# EAGLE design Arduino-DUE-SHEILD-4X4 (EAGLE 8.1.0)
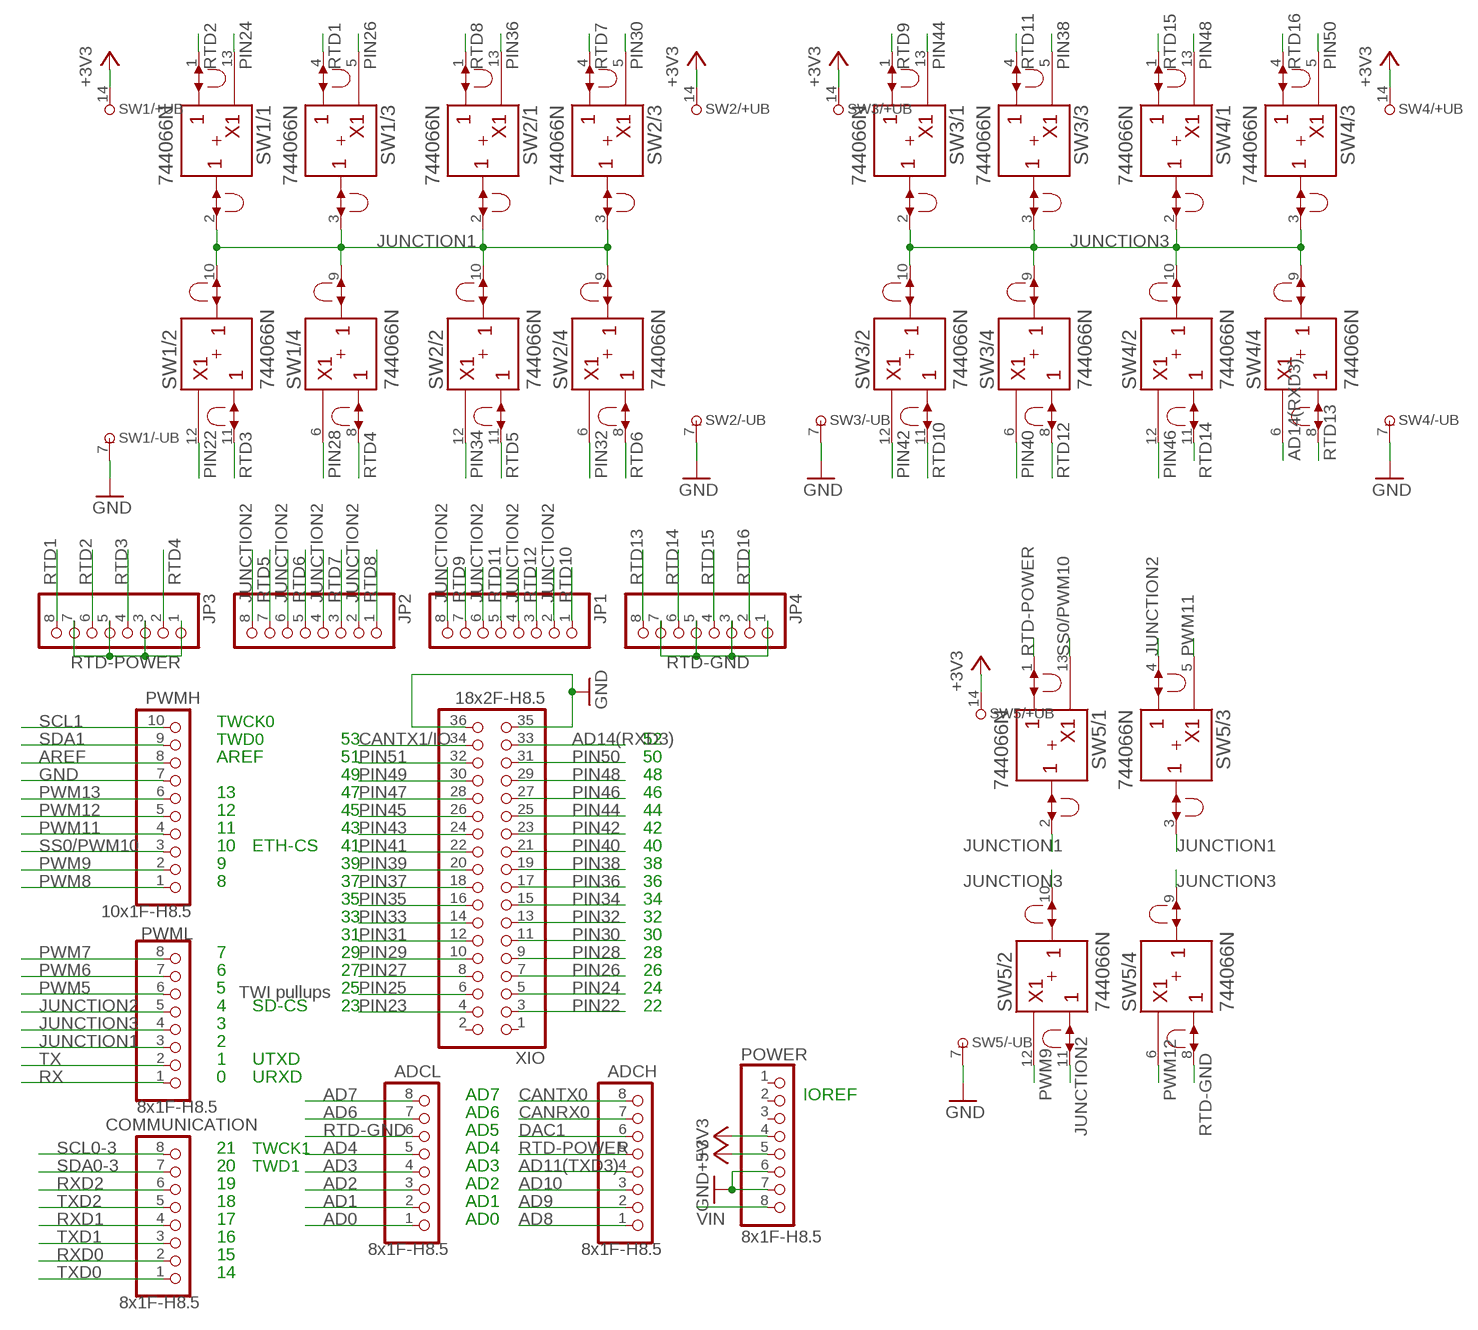
[diagram p0: schematic, sheet 1]

## Parts
ADCH  8x1F-H8.5  PINHD-1X8  [1X08]
ADCL  8x1F-H8.5  PINHD-1X8  [1X08]
COMMUNICATION  8x1F-H8.5  PINHD-1X8  [1X08]
JP1  PINHD-1X8  [1X08]
JP2  PINHD-1X8  [1X08]
JP3  PINHD-1X8  [1X08]
JP4  PINHD-1X8  [1X08]
POWER  8x1F-H8.5  PINHD-1X8  [1X08]
PWMH  10x1F-H8.5  PINHD-1X10  [1X10]
PWML  8x1F-H8.5  PINHD-1X8  [1X08]
SW1  744066N  [DIL14]
SW2  744066N  [DIL14]
SW3  744066N  [DIL14]
SW4  744066N  [DIL14]
SW5  744066N  [DIL14]
XIO  18x2F-H8.5  PINHD-2X18  [2X18]

## Nets
+3V3: POWER.4 SW1.14(/+UB:+UB) SW2.14(/+UB:+UB) SW3.14(/+UB:+UB) SW4.14(/+UB:+UB) SW5.14(/+UB:+UB)
+5V: POWER.5
AD0: ADCL.1
AD1: ADCL.2
AD2: ADCL.3
AD3: ADCL.4
AD4: ADCL.5
AD6: ADCL.7
AD7: ADCL.8
AD8: ADCH.1
AD9: ADCH.2
AD10: ADCH.3
AD11(TXD3): ADCH.4
AD14(RXD3): SW4.6(/4:C) XIO.33
AREF: PWMH.8
CANRX0: ADCH.7
CANTX0: ADCH.8
CANTX1/IO: XIO.34
DAC1: ADCH.6
GND: POWER.6 POWER.7 PWMH.7 SW1.7(/-UB:-UB) SW2.7(/-UB:-UB) SW3.7(/-UB:-UB) SW4.7(/-UB:-UB) SW5.7(/-UB:-UB) XIO.35 XIO.36
JUNCTION1: PWML.3 SW1.2(/1:B) SW1.3(/3:B) SW1.9(/4:B) SW1.10(/2:B) SW2.2(/1:B) SW2.3(/3:B) SW2.9(/4:B) SW2.10(/2:B) SW5.2(/1:B) SW5.3(/3:B)
JUNCTION2: JP1.2 JP1.4 JP1.6 JP1.8 JP2.2 JP2.4 JP2.6 JP2.8 PWML.5 SW5.4(/3:A) SW5.11(/2:A)
JUNCTION3: PWML.4 SW3.2(/1:B) SW3.3(/3:B) SW3.9(/4:B) SW3.10(/2:B) SW4.2(/1:B) SW4.3(/3:B) SW4.9(/4:B) SW4.10(/2:B) SW5.9(/4:B) SW5.10(/2:B)
PIN22: SW1.12(/2:C) XIO.3
PIN23: XIO.4
PIN24: SW1.13(/1:C) XIO.5
PIN25: XIO.6
PIN26: SW1.5(/3:C) XIO.7
PIN27: XIO.8
PIN28: SW1.6(/4:C) XIO.9
PIN29: XIO.10
PIN30: SW2.5(/3:C) XIO.11
PIN31: XIO.12
PIN32: SW2.6(/4:C) XIO.13
PIN33: XIO.14
PIN34: SW2.12(/2:C) XIO.15
PIN35: XIO.16
PIN36: SW2.13(/1:C) XIO.17
PIN37: XIO.18
PIN38: SW3.5(/3:C) XIO.19
PIN39: XIO.20
PIN40: SW3.6(/4:C) XIO.21
PIN41: XIO.22
PIN42: SW3.12(/2:C) XIO.23
PIN43: XIO.24
PIN44: SW3.13(/1:C) XIO.25
PIN45: XIO.26
PIN46: SW4.12(/2:C) XIO.27
PIN47: XIO.28
PIN48: SW4.13(/1:C) XIO.29
PIN49: XIO.30
PIN50: SW4.5(/3:C) XIO.31
PIN51: XIO.32
PWM5: PWML.6
PWM6: PWML.7
PWM7: PWML.8
PWM8: PWMH.1
PWM9: PWMH.2 SW5.12(/2:C)
PWM11: PWMH.4 SW5.5(/3:C)
PWM12: PWMH.5 SW5.6(/4:C)
PWM13: PWMH.6
RTD1: JP3.8 SW1.4(/3:A)
RTD2: JP3.6 SW1.1(/1:A)
RTD3: JP3.4 SW1.11(/2:A)
RTD4: JP3.2 SW1.8(/4:A)
RTD5: JP2.7 SW2.11(/2:A)
RTD6: JP2.5 SW2.8(/4:A)
RTD7: JP2.3 SW2.4(/3:A)
RTD8: JP2.1 SW2.1(/1:A)
RTD9: JP1.7 SW3.1(/1:A)
RTD10: JP1.1 SW3.11(/2:A)
RTD11: JP1.5 SW3.4(/3:A)
RTD12: JP1.3 SW3.8(/4:A)
RTD13: JP4.8 SW4.8(/4:A)
RTD14: JP4.6 SW4.11(/2:A)
RTD15: JP4.4 SW4.1(/1:A)
RTD16: JP4.2 SW4.4(/3:A)
RTD-GND: ADCL.6 JP4.1 JP4.3 JP4.5 JP4.7 SW5.8(/4:A)
RTD-POWER: ADCH.5 JP3.1 JP3.3 JP3.5 JP3.7 SW5.1(/1:A)
RX: PWML.1
RXD0: COMMUNICATION.2
RXD1: COMMUNICATION.4
RXD2: COMMUNICATION.6
SCL0-3: COMMUNICATION.8
SCL1: PWMH.10
SDA0-3: COMMUNICATION.7
SDA1: PWMH.9
SS0/PWM10: PWMH.3 SW5.13(/1:C)
TX: PWML.2
TXD0: COMMUNICATION.1
TXD1: COMMUNICATION.3
TXD2: COMMUNICATION.5
VIN: POWER.8
Unconnected: POWER.1 POWER.2 POWER.3 XIO.1 XIO.2

## Notes on the sheet
- TWCK0
- TWD0 | 53 | 52
- AREF | 51 | 50
- 49 | 48
- 13 | 47 | 46
- 12 | 45 | 44
- 11 | 43 | 42
- 10 | ETH-CS | 41 | 40
- 9 | 39 | 38
- 8 | 37 | 36
- 35 | 34
- 33 | 32
- 31 | 30
- 7 | 29 | 28
- 6 | 27 | 26
- 5 | TWI pullups | 25 | 24
- 4 | SD-CS | 23 | 22
- 3
- 2
- 1 | UTXD
- 0 | URXD
- AD7 | IOREF
- AD6
- AD5
- 21 | TWCK1 | AD4
- 20 | TWD1 | AD3
- 19 | AD2
- 18 | AD1
- 17 | AD0
- 16
- 15
- 14

## Library data of the parts
ADCH ADCL COMMUNICATION POWER PWML = SmartPrj:PINHD-1X8: PIN HEADER
JP1-JP4 = pinhead:PINHD-1X8: PIN HEADER
PWMH = SmartPrj:PINHD-1X10: PIN HEADER
SW1-SW5 = 74ttl-din:74*4066: Quad analog SWITCH
XIO = SmartPrj:PINHD-2X18: PIN HEADER

## Net classes
0 default: width 0.203 mm, drill 0.406 mm, clearance 0.203 mm
1 USB: width 0.203 mm, drill 0.406 mm, clearance 0.203 mm
2 gnd: width 0.203 mm, drill 0.406 mm, clearance 0.203 mm
3 usbvcc: width 0.203 mm, drill 0.406 mm, clearance 0.203 mm
4 USBpair: width 0.254 mm, drill 0.406 mm, clearance 0.61 mm

## Board
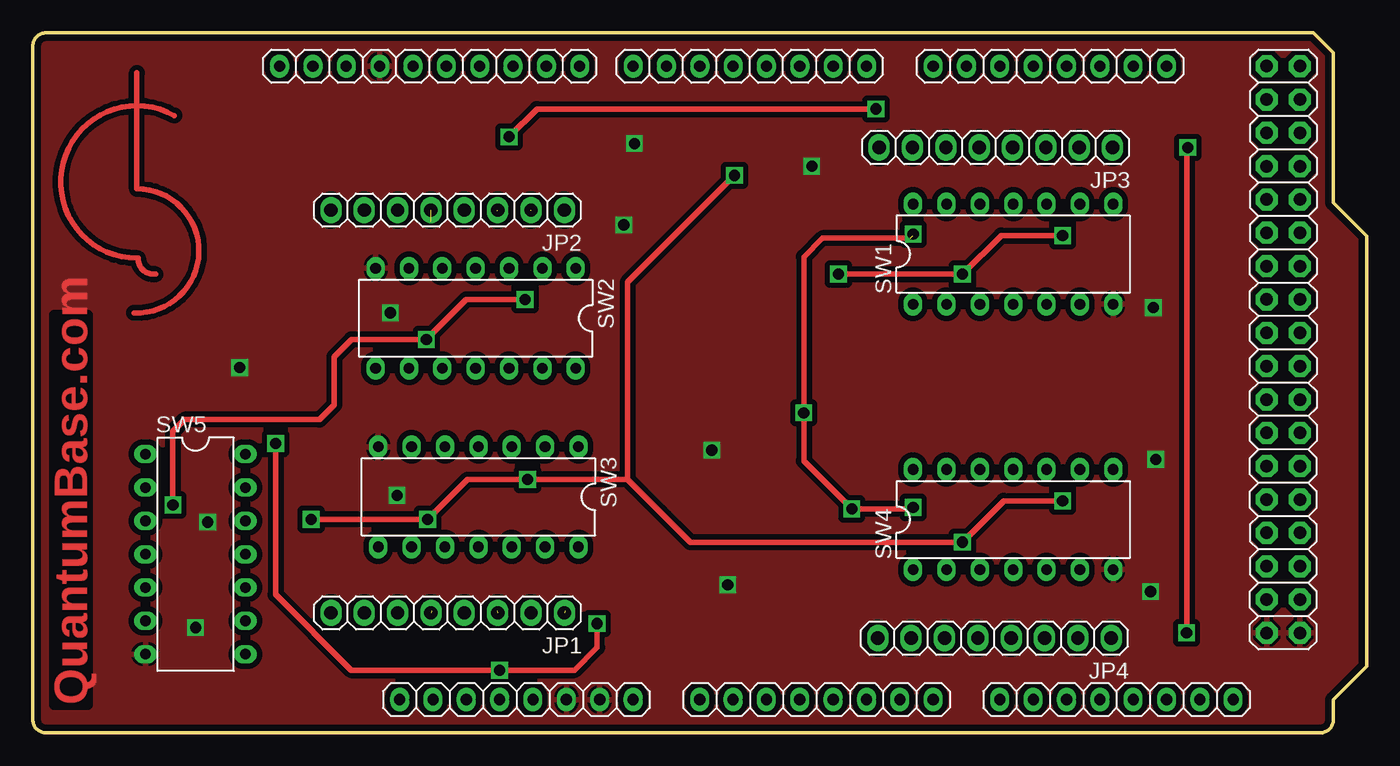
[diagram p1: board, top side]
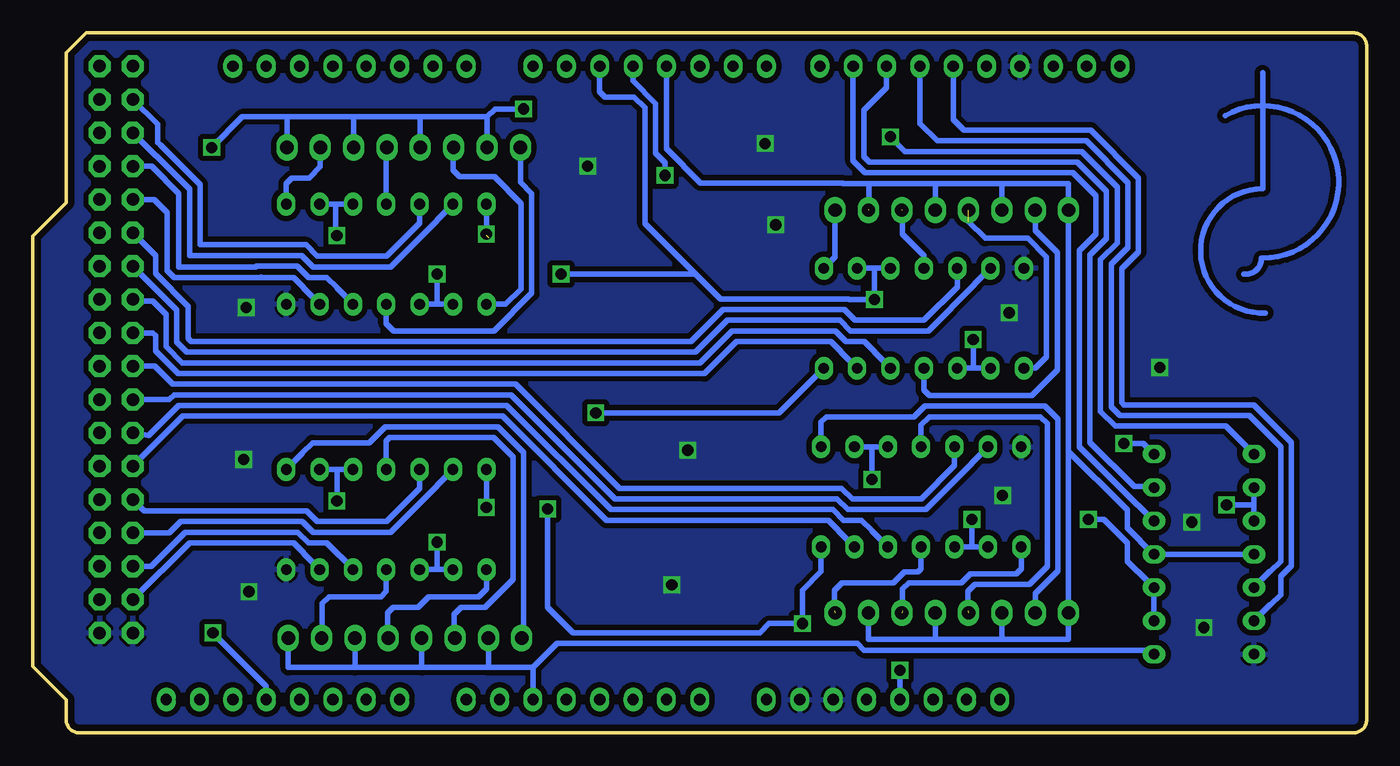
[diagram p2: board, bottom side, seen from below]

Size 101.6 x 53.34 mm. Coordinates in mm from the lower left corner, seen from the top.
Outline: 97.54,53.34 99.06,51.82 99.06,40.39 101.6,37.85 101.6,5.08 99.06,2.54 99.06,1 arc-90 98.06,0 1,0 arc-90 0,1 0,52.34 arc-90 1,53.34 97.54,53.34
Copper layers (1*16): Top 0.035mm / dielectric 1.6mm / Bottom 0.035mm
Design rules "default *": minimum track width 8mil, minimum drill 16mil, track to track 16mil, track to pad 16mil, pad to pad 16mil, via to via 16mil, smd to smd 12mil, copper to edge 20mil, drill to drill 12mil, minimum pad ring 12mil, minimum via ring 8mil, stop-mask expansion 2mil, vias tented up to drill 25mil, thermal gap 8mil

### Footprints (pad centres in the part's own frame; a part is rotated, then mirrored left to right if it is on the bottom)
1X08 = drill 0.85 pad 1.422 long: 1 -8.89,0; 2 -6.35,0; 3 -3.81,0; 4 -1.27,0; 5 1.27,0; 6 3.81,0; 7 6.35,0; 8 8.89,0
1X08' = drill 1.016 long: 1 -8.89,0; 2 -6.35,0; 3 -3.81,0; 4 -1.27,0; 5 1.27,0; 6 3.81,0; 7 6.35,0; 8 8.89,0
1X10 = drill 0.85 pad 1.422 long: 1 -11.43,0; 2 -8.89,0; 3 -6.35,0; 4 -3.81,0; 5 -1.27,0; 6 1.27,0; 7 3.81,0; 8 6.35,0; 9 8.89,0; 10 11.43,0
DIL14 = drill 0.813 long: 1 -7.62,-3.81; 2 -5.08,-3.81; 3 -2.54,-3.81; 4 0,-3.81; 5 2.54,-3.81; 6 5.08,-3.81; 7 7.62,-3.81; 8 7.62,3.81; 9 5.08,3.81; 10 2.54,3.81; 11 0,3.81; 12 -2.54,3.81; 13 -5.08,3.81; 14 -7.62,3.81
2X18 = drill 0.95 pad 1.676 octagon: 1 -21.59,-1.27; 2 -21.59,1.27; 3 -19.05,-1.27; 4 -19.05,1.27; 5 -16.51,-1.27; 6 -16.51,1.27; 7 -13.97,-1.27; 8 -13.97,1.27; 9 -11.43,-1.27; 10 -11.43,1.27; 11 -8.89,-1.27; 12 -8.89,1.27; 13 -6.35,-1.27; 14 -6.35,1.27; 15 -3.81,-1.27; 16 -3.81,1.27; 17 -1.27,-1.27; 18 -1.27,1.27; 19 1.27,-1.27; 20 1.27,1.27; 21 3.81,-1.27; 22 3.81,1.27; 23 6.35,-1.27; 24 6.35,1.27; 25 8.89,-1.27; 26 8.89,1.27; 27 11.43,-1.27; 28 11.43,1.27; 29 13.97,-1.27; 30 13.97,1.27; 31 16.51,-1.27; 32 16.51,1.27; 33 19.05,-1.27; 34 19.05,1.27; 35 21.59,-1.27; 36 21.59,1.27

### Placement (x,y rotation side)
ADCH  82.55,2.54 0 top
ADCL  59.69,2.54 0 top
COMMUNICATION  77.47,50.8 0 top
JP1  [1X08']  31.6,9.14 180 top
JP2  [1X08']  31.6,39.83 180 top
JP3  [1X08']  73.36,44.6 180 top
JP4  [1X08']  73.25,7.21 180 top
POWER  36.83,2.54 0 top
PWMH  30.23,50.8 180 top
PWML  54.61,50.8 180 top
SW1  74.68,36.47 0 top
SW2  33.73,31.6 180 top
SW3  33.93,17.98 180 top
SW4  74.68,16.26 0 top
SW5  12.4,13.61 270 top
XIO  95.25,29.21 270 top

### Tracks (layer width: path | path; a pad name or v marks a point on that pad's centre or on a via)
+3V3  (via drill 0.85 pad 1.02)  (1 unrouted)
  Top 0.406: v67.06,17.17 66.95,17.07 v62.38,17.07 58.73,20.73 v58.73,24.38 58.73,36.27 60.15,37.69 66.85,37.69 | v18.49,22.05 18.49,10.54 24.25,4.78 v35.56,4.78 41.25,4.78 42.98,6.5 v42.98,8.33
  Bottom 0.406: POWER.4 v35.56,4.78 v35.56,4.79 | 41.6,14.22 SW3.14 41.55,12.29 42.98,10.87 v42.98,8.33 45.52,8.33 46.23,7.62 60.45,7.62 62.38,9.55 v62.38,17.07 | v67.06,17.17 SW4.14 | 67.06,37.9 v67.06,38 SW1.14 | SW2.14 44.76,24.38 v58.73,24.38 | SW5.14 17.02,22.05 v18.49,22.05
AD14(RXD3)
  Bottom 0.406: SW4.6 80.97,13.66 80.97,13.7 81.75,14.48 89.66,14.48 XIO.33
GND  (via drill 0.85 pad 1.02)
  other vias: 15.75,27.84 13.31,16.05 12.4,8.03 52.93,11.28 51.71,21.54 45.01,38.71 45.82,44.91 59.33,43.18 85.34,32.41 85.55,20.83 85.14,10.77 27.74,18.08 27.23,32
  pour Top: -1.42,54.46 103.73,54.46 103.73,-2.95 -1.42,-2.95
  pour Bottom: -2.13,54.36 104.04,54.36 104.04,-2.54 -2.13,-2.54
JUNCTION1  (via drill 0.85 pad 0.81, 0.85 pad 1.02)
  Top 0.406: v37.49,33.02 33.02,33.02 v29.97,29.97 24.28,29.97 22.96,28.65 22.96,24.99 21.84,23.88 11.58,23.88 10.67,22.96 v10.67,17.37 | v78.44,37.9 73.76,37.9 v70.81,34.95 v61.37,34.95
  Bottom 0.406: 70.81,32.66 SW1.2 | 70.81,32.66 SW1.3 | SW2.2 37.49,35.41 | 37.49,35.41 SW2.3 | 29.97,27.79 SW2.10 | 29.97,27.79 SW2.9 | v70.81,34.95 70.81,32.66 | 37.49,35.41 v37.49,33.02 39.41,33.02 39.46,33.07 49.23,33.07 51.1,34.95 | 78.54,40.28 SW1.9 | 78.54,40.28 SW1.10 | 8.59,17.37 SW5.2 | 8.59,17.37 SW5.3 | 29.97,27.79 v29.97,29.97 | PWML.3 58.42,48.87 58,48.45 55.79,48.45 54.97,47.62 54.97,38.81 51.1,34.95 | v78.44,37.9 78.54,38 78.54,40.28 | v10.67,17.37 8.59,17.37 | v61.37,34.95 51.1,34.95
JUNCTION2  (1 unrouted)
  Bottom 0.406: 37.9,41.86 32.82,41.86 | 32.82,41.86 27.74,41.86 | 27.74,41.86 22.71,41.86 JP2.8 22.71,21.46 | 37.9,41.86 37.9,39.83 | SW5.4 SW5.11 16.24,13.61 18.24,15.61 18.24,17 18.5,17.26 18.51,17.26 22.71,21.46 | 37.9,41.86 39.9,41.86 39.93,41.9 50.74,41.9 53.34,44.5 PWML.5 | 27.74,41.86 27.79,41.81 JP2.6 | 32.82,41.86 32.87,41.81 JP2.4 | 22.71,21.46 JP1.8 22.71,7.11 27.79,7.11 | JP1.6 27.79,7.11 | 27.79,7.11 32.87,7.11 | 32.87,7.11 JP1.4 | 32.87,7.11 37.95,7.11 JP1.2
JUNCTION3  (via drill 0.85 pad 1.02)
  Top 0.406: 45.31,19.3 v37.69,19.3 33.12,19.3 v30.07,16.26 v21.2,16.26 | 45.31,19.3 50.09,14.53 v70.81,14.53 73.97,17.68 v78.44,17.68 | v53.45,42.48 45.31,34.34 45.31,19.3
  Bottom 0.406: 78.44,20.07 SW4.9 | 78.44,20.07 SW4.10 | 30.07,14.17 SW3.10 | 30.07,14.17 SW3.9 | SW3.2 37.69,21.79 | 37.69,21.79 SW3.3 | 70.92,12.45 SW4.2 | 70.92,12.45 SW4.3 | 37.69,21.79 v37.69,19.3 | v70.81,14.53 70.81,12.55 70.92,12.45 | PWML.4 55.88,49.68 54.15,47.95 54.15,44.16 53.45,43.47 v53.45,42.48 | SW5.9 SW5.10 17.42,12.29 17.46,12.29 18.24,13.07 18.24,14.46 20.04,16.26 v21.2,16.26 | v30.07,16.26 30.07,14.17 | v78.44,17.68 78.44,20.07
N$1
  Top 0.406: 7.92,50.29 7.92,41.45 arc-182 7.72,32
N$2
  Bottom 0.406: 7.92,36.17 arc-209 10.77,47.04
N$4
  Bottom 0.406: 9.35,34.95 arc-97 8.03,36.17
N$8
  Bottom 0.406: 7.92,50.29 7.92,41.45 arc-182 7.72,32
N$9
  Top 0.406: 7.92,36.17 arc-209 10.77,47.04
N$10
  Top 0.406: 9.35,34.95 arc-97 8.03,36.17
PIN22
  Bottom 0.406: 72.14,38.85 SW1.12 72.14,38.85 | 72.14,38.85 74.67,36.32 79.93,36.32 80.79,37.19 88.86,37.19 88.86,41.78 91.88,44.81 91.92,44.81 92.08,44.97 92.08,46.36 XIO.3
PIN24
  Bottom 0.406: SW1.13 70.81,39.06 70.81,39.03 74.33,35.51 80.26,35.51 81.13,36.37 89.67,36.37 89.67,41.44 92.22,43.99 92.25,43.99 XIO.5
PIN26
  Bottom 0.406: 93.75,43.18 XIO.7 92.56,43.18 90.48,41.1 90.48,35.51 84.61,35.51 84.56,35.56 81.46,35.56 80.6,34.7 79.21,34.7 78.44,33.92 78.44,33.88 SW1.5
PIN28
  Bottom 0.406: SW1.6 80.97,33.88 80.97,33.92 81.75,34.7 84.18,34.7 | 84.23,34.75 84.18,34.7 | 84.18,34.7 90.82,34.7 91.36,35.24 91.36,39.64 92.35,40.64 XIO.9
PIN30
  Bottom 0.406: 31.19,33.98 SW2.5 31.19,33.98 | 31.19,33.98 33.72,31.45 38.98,31.45 39.79,32.26 49.02,32.26 51.45,29.82 89.53,29.82 89.75,30.04 89.75,32.48 92.25,34.98 92.25,36.37 XIO.11
PIN32
  Bottom 0.406: SW2.6 29.87,34.19 | 29.87,34.19 29.87,34.15 | 29.87,34.19 29.87,34.15 | 29.87,34.15 33.39,30.63 39.32,30.63 40.13,31.45 48.68,31.45 51.12,29.01 89.87,29.01 90.63,29.76 90.63,32.21 XIO.13
PIN34
  Bottom 0.406: SW2.12 37.49,29.01 | 37.49,29.01 37.49,29.05 | 37.49,29.01 37.49,29.05 | 37.49,29.05 38.26,29.82 39.66,29.82 40.47,30.63 48.34,30.63 50.78,28.19 90.21,28.19 91.44,29.43 91.44,31.87 92.47,32.9 93.86,32.9 XIO.15
PIN36
  Bottom 0.406: SW2.13 40.03,29.01 40.03,29.05 40.8,29.82 48.01,29.82 50.44,27.38 90.55,27.38 92.25,29.09 92.25,30.28 92.46,30.48 XIO.17 93.88,30.48
PIN38
  Bottom 0.406: SW3.5 31.39,20.36 33.93,17.83 39.18,17.83 40,18.64 56.9,18.64 64.83,26.57 90.93,26.57 92.3,27.94 XIO.19
PIN40
  Bottom 0.406: XIO.21 91.2,25.4 90.84,25.76 65.16,25.76 57.24,17.83 40.33,17.83 39.52,17.02 33.59,17.02 30.07,20.54 30.07,20.57 SW3.6
PIN42
  Bottom 0.406: 36.63,14.17 SW3.12 37.69,15.39 37.69,15.43 38.47,16.2 39.86,16.2 40.67,17.02 57.57,17.02 65.5,24.94 90.51,24.94 92.78,22.67 XIO.23
PIN44
  Bottom 0.406: 39.26,14.17 SW3.13 40.23,15.39 40.23,15.43 41.01,16.2 57.91,16.2 65.84,24.13 90.17,24.13 XIO.25
PIN46
  Bottom 0.406: SW4.12 72.14,18.64 74.67,16.1 79.93,16.1 80.74,16.92 93.12,16.92 XIO.27
PIN48
  Bottom 0.406: SW4.13 70.81,18.85 70.81,18.81 74.33,15.29 80.26,15.29 81.08,16.1 90.33,16.1 91.2,15.24 XIO.29
PIN50
  Bottom 0.406: SW4.5 77.22,12.48 79.21,14.48 80.6,14.48 81.41,15.29 90,15.29 92.59,12.7 XIO.31
PWM9
  Bottom 0.406: PWMH.2 39.12,43.59 38.2,42.67 22.37,42.67 20.62,40.93 20.62,38 21.89,36.73 21.89,21.79 21.88,21.79 17.46,17.37 17.42,17.37 SW5.12
PWM11
  Bottom 0.406: PWMH.4 34.04,46.43 32.72,45.11 21.36,45.11 18.19,41.94 18.19,36.99 19.46,35.72 19.46,24.82 18.82,24.18 8.95,24.18 6.55,21.78 6.55,13.07 7.33,12.29 7.37,12.29 SW5.5
PWM12
  Bottom 0.406: PWMH.5 31.5,46.74 30.68,45.92 21.02,45.92 17.37,42.27 17.37,36.65 18.64,35.38 18.64,25.16 18.48,24.99 8.62,24.99 5.74,22.12 5.74,12.73 6.55,11.92 6.55,10.53 7.33,9.75 7.37,9.75 SW5.6
RTD1
  Bottom 0.406: SW1.4 74.68,31.19 74.12,30.63 66.47,30.63 63.6,33.5 63.6,41.1 64.47,41.96 JP3.8
RTD2
  Bottom 0.406: SW1.1 65.58,32.66 64.41,33.83 64.41,40.34 66.45,42.37 69.09,42.37 69.6,42.88 69.6,44.55 JP3.6
RTD3
  Bottom 0.406: SW1.11 74.68,44.55 JP3.4
RTD4
  Bottom 0.406: JP3.2 79.7,43.13 80.57,42.27 81.89,42.27 82.3,41.86 SW1.8
RTD5
  Bottom 0.406: SW2.11 33.73,26.11 33.33,25.7 25.5,25.7 23.57,27.64 23.57,36.61 25.25,38.28 JP2.7
RTD6  (1 unrouted)
  Bottom 0.406: SW2.8 25.25,27.79 24.38,28.65 24.38,36.27 25.81,37.69 29.06,37.69 30.33,38.96
RTD7  (1 unrouted)
  Bottom 0.406: SW2.4 33.73,36.37 35.36,38 35.36,39.78
RTD8
  Bottom 0.406: JP2.1 40.49,36.27 SW2.1
RTD9
  Bottom 0.406: SW3.1 41.55,23.67 41.15,24.08 34.47,24.08 33.66,24.89 24.5,24.89 23.52,23.91 23.52,12.34 25.25,10.62 JP1.7
RTD10  (1 unrouted)
  Bottom 0.406: 40.54,9.3 40.54,10.87 39.96,11.45 36.03,11.45 35.22,12.26 34.17,12.26 33.93,12.5 SW3.11
RTD11  (1 unrouted)
  Bottom 0.406: 30.38,9.3 30.38,10.77 29.83,11.31 25.7,11.31 24.33,12.68 24.33,23.57 24.84,24.08 33.33,24.08 33.93,23.47 SW3.4
RTD12  (1 unrouted)
  Bottom 0.406: 35.36,9.3 35.36,10.97 34.88,11.45 30.85,11.45 30.17,12.13 26.68,12.13 26.31,12.5 SW3.8
RTD13
  Bottom 0.406: JP4.8 64.21,7.37 64.21,21.36 66.17,23.32 74.76,23.32 75.98,22.1 80.3,22.1 81.08,21.32 81.08,21.29 SW4.8
RTD14
  Bottom 0.406: SW4.11 74.68,22.25 74.42,22.5 66.51,22.5 65.02,21.02 65.02,11.68 67.16,9.55 68.99,9.55 69.49,9.04 69.49,7.26 JP4.6
RTD15
  Bottom 0.406: SW4.1 67.06,10.97 67.67,10.36 71.46,10.36 72.27,9.55 74.17,9.55 74.57,9.14 74.57,7.26 JP4.4
RTD16
  Bottom 0.406: SW4.4 74.68,10.77 75.08,10.36 79.05,10.36 79.55,9.86 79.55,7.26 JP4.2
RTD-GND
  Bottom 0.406: JP4.7 66.9,4.98 | 66.9,4.98 63.5,4.98 | 66.9,4.98 71.98,4.98 | 71.98,4.98 JP4.5 | 71.98,4.98 77.06,4.98 | 77.06,4.98 JP4.3 | 77.06,4.98 82.14,4.98 JP4.1 | 63.5,4.98 ADCL.6 | SW5.8 16.51,6.3 38.28,6.3 38.79,6.81 61.67,6.81 63.5,4.98
RTD-POWER  (via drill 0.85 pad 1.02)
  Top 0.406: v87.99,44.6 87.88,44.5 v87.88,7.62 | v36.27,45.41 38.39,47.54 v64.21,47.54
  Bottom 0.406: 67,46.94 JP3.7 | JP3.5 72.08,46.94 | 67,46.94 72.08,46.94 | 72.08,46.94 77.17,46.94 | 77.17,46.94 JP3.3 | 77.17,46.94 82.25,46.94 | 82.25,46.94 JP3.1 | 82.25,46.94 85.65,46.94 v87.99,44.6 | v87.88,7.62 83.82,3.56 ADCH.5 | v36.27,45.41 35.15,44.3 21.7,44.3 19,41.6 19,37.33 20.27,36.05 20.27,24.49 19.15,23.37 10.72,23.37 SW5.1 | 67,46.94 66.41,47.54 v64.21,47.54
SS0/PWM10
  Bottom 0.406: PWMH.3 36.58,49.17 38.3,47.45 38.3,43.92 37.87,43.48 22.03,43.48 19.81,41.26 19.81,37.66 21.08,36.39 21.08,22.14 17.71,18.77 16.28,18.77 SW5.13

### Text on the board
Top: QuantumBase.com